# Altium schematic sheet CutMonitor_Motor.SchDoc
size 594 x 420 mm; DocumentNumber: ФНКЦ.452312.001 Э3; SheetNumber: 2; Format: A2
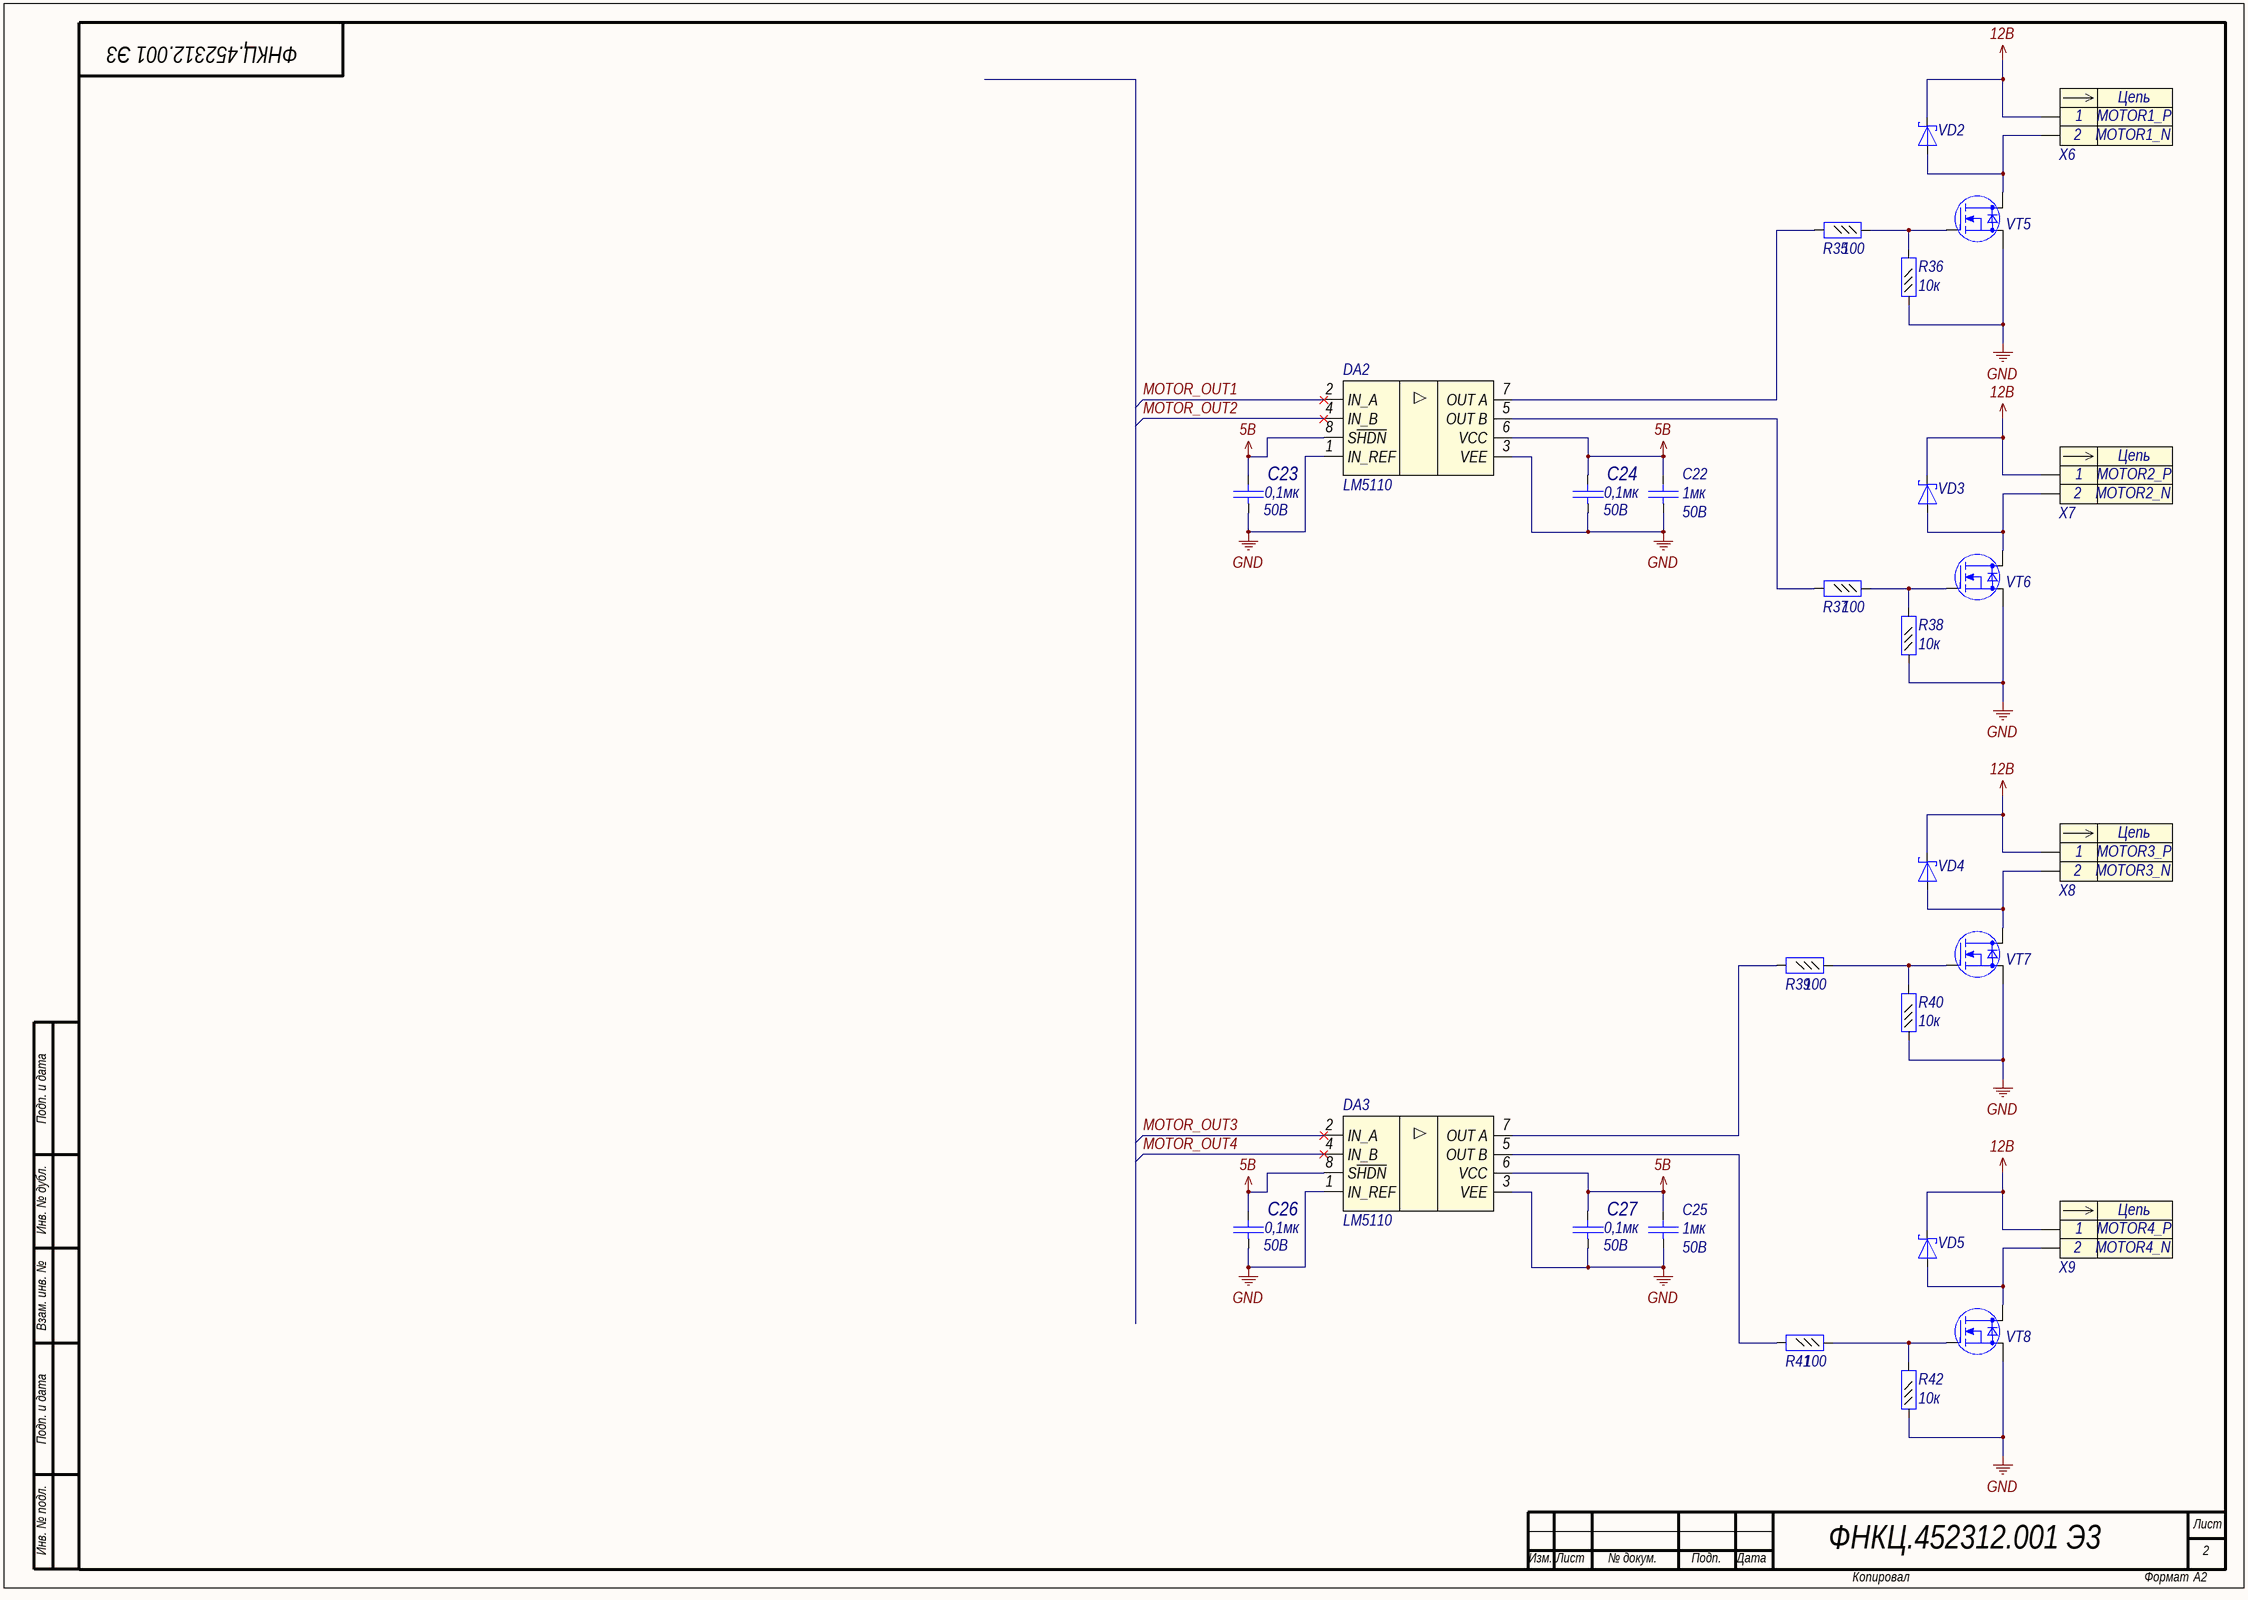
[diagram p0: CutMonitor_Motor.SchDoc]

## Parts
C22  value 1мк  Voltage: 50B  [C0805]  (hidden comment: Capacitor)
C23  value 0,1мк  Voltage: 50B  [C0603]  (hidden comment: Capacitor)
C24  value 0,1мк  Voltage: 50B  [C0603]  (hidden comment: Capacitor)
C25  value 1мк  Voltage: 50B  [C0805]  (hidden comment: Capacitor)
C26  value 0,1мк  Voltage: 50B  [C0603]  (hidden comment: Capacitor)
C27  value 0,1мк  Voltage: 50B  [C0603]  (hidden comment: Capacitor)
DA2  LM5110  [SO8]
DA3  LM5110  [SO8]
R35  value 100  [R0603]  (hidden comment: Resistor_0,062Вт)
R36  value 10к  [R0603]  (hidden comment: Resistor_0,062Вт)
R37  value 100  [R0603]  (hidden comment: Resistor_0,062Вт)
R38  value 10к  [R0603]  (hidden comment: Resistor_0,062Вт)
R39  value 100  [R0603]  (hidden comment: Resistor_0,062Вт)
R40  value 10к  [R0603]  (hidden comment: Resistor_0,062Вт)
R41  value 100  [R0603]  (hidden comment: Resistor_0,062Вт)
R42  value 10к  [R0603]  (hidden comment: Resistor_0,062Вт)
VD2  DiodeSchottky  [SOD-323]  (value not drawn)
VD3  DiodeSchottky  [SOD-323]  (value not drawn)
VD4  DiodeSchottky  [SOD-323]  (value not drawn)
VD5  DiodeSchottky  [SOD-323]  (value not drawn)
VT5  N-MOSFET  [DPAK]  (value not drawn)
VT6  N-MOSFET  [DPAK]  (value not drawn)
VT7  N-MOSFET  [DPAK]  (value not drawn)
VT8  N-MOSFET  [DPAK]  (value not drawn)
X6  (no value)  [JUMPER_2.54]
X7  (no value)  [JUMPER_2.54]
X8  (no value)  [JUMPER_2.54]
X9  (no value)  [JUMPER_2.54]

## Nets
5В: C22.2 C23.2 C24.2 C25.2 C26.2 C27.2 DA2.6(VCC) DA2.8(S~{HDN}) DA3.6(VCC) DA3.8(S~{HDN})
12B: VD2.1(K) VD3.1(K) VD4.1(K) VD5.1(K) X6.1 X7.1 X8.1 X9.1
GND: C22.1 C23.1 C24.1 C25.1 C26.1 C27.1 DA2.1(IN_REF) DA2.3(VEE) DA3.1(IN_REF) DA3.3(VEE) R36.1 R38.1 R40.1 R42.1 VT5.3(S) VT6.3(S) VT7.3(S) VT8.3(S)
MOTOR_OUT1: DA2.2(IN_A)
MOTOR_OUT2: DA2.4(IN_B)
MOTOR_OUT3: DA3.2(IN_A)
MOTOR_OUT4: DA3.4(IN_B)
NetDA2_5: DA2.5(OUT_B) R37.2
NetDA2_7: DA2.7(OUT_A) R35.2
NetDA3_5: DA3.5(OUT_B) R41.2
NetDA3_7: DA3.7(OUT_A) R39.2
NetR35_1: R35.1 R36.2 VT5.1(G)
NetR37_1: R37.1 R38.2 VT6.1(G)
NetR39_1: R39.1 R40.2 VT7.1(G)
NetR41_1: R41.1 R42.2 VT8.1(G)
NetVD2_2: VD2.2(A) VT5.2(D) X6.2
NetVD3_2: VD3.2(A) VT6.2(D) X7.2
NetVD4_2: VD4.2(A) VT7.2(D) X8.2
NetVD5_2: VD5.2(A) VT8.2(D) X9.2

## Notes on the sheet
- Подп. и дата
- Инв. № дубл.
- Взам. инв. №
- Инв. № подл.
- Лист
- Изм.
- № докум.
- Подп.
- Дата
- Копировал
- Формат
- (in symbol connect54) Цепь

## Library data of the parts
C22 C25 = cap151: Конденсатор; Part Name: Ceramic; Manufacture: Murata; Part Number: GRM21BR71H105K; id: cap151; TKE: X7R
C23 C24 C26 C27 = cap131: Конденсатор; Part Name: Ceramic; Manufacture: Murata; Part Number: GRM188R71H104KA93D; id: cap131; TKE: X7R
DA2 DA3 = driver15: Driver 5A 2-OUT Low Side Inv/Non-Inv; Part Name: Dual 5-A Compound Gate Driver; Manufacture: Texas Instruments; Part Number: LM5110-1M; Logic High: 2,2В; Logic Low: 0,8B; Operating Supply Voltage: 3,5-14B; Min Operating Supply Voltage: (-)0,3B; Max Operating Supply Voltage: 15B; “A” OUTPUT: Noninverting; id: driver15; “B” OUTPUT: Noninverting; Maximum output current: 5A
R35 R37 R39 R41 = res435: Резистор; Manufacture: Yageo; Part Number: RC0603FR-07100RL; id: res435; Accuracy: 0,01; Part Name: Resistor; Power: 0,062Вт
R36 R38 R40 R42 = res483: Резистор; Manufacture: Yageo; Part Number: RC0603FR-0710KL; id: res483; Accuracy: 0,01; Part Name: Resistor; Power: 0,062Вт
VD2-VD5 = diode19: Диод Шоттки; Part Number: PMEG4010BEA.115; Manufacture: NXP Semiconductor; Max Reverse Voltage: 40B; Forward Voltage: 0,64B; Forward Current: 10mA; Capacitance: 50pF; Number of Channels: 1; id: diode19; Part Name: Diode Schottky
VT5-VT8 = mosfert9: Part Number: IRLR2905ZPBF; Manufacturer: International Rectifier; Structure: n-channel; V drain-source max: 55B; Rds: 0,0135Ohm; Gate-to-source voltage: (+-)16B; Continuous drain current: 60A; Total gate charge: 23nC; Pulsed drain current: 240A; Power dissipation: 110W; id: mosfert9
X6 = connect54: Разъем - 2 конт. вилка; Part Name: Jumper 2,54mm; Contact_1: MOTOR1_P; Contact_2: MOTOR1_N; Etch: 2,54mm; id: connect54
X7 = connect54: Разъем - 2 конт. вилка; Part Name: Jumper 2,54mm; Contact_1: MOTOR2_P; Contact_2: MOTOR2_N; Etch: 2,54mm; id: connect54
X8 = connect54: Разъем - 2 конт. вилка; Part Name: Jumper 2,54mm; Contact_1: MOTOR3_P; Contact_2: MOTOR3_N; Etch: 2,54mm; id: connect54
X9 = connect54: Разъем - 2 конт. вилка; Part Name: Jumper 2,54mm; Contact_1: MOTOR4_P; Contact_2: MOTOR4_N; Etch: 2,54mm; id: connect54